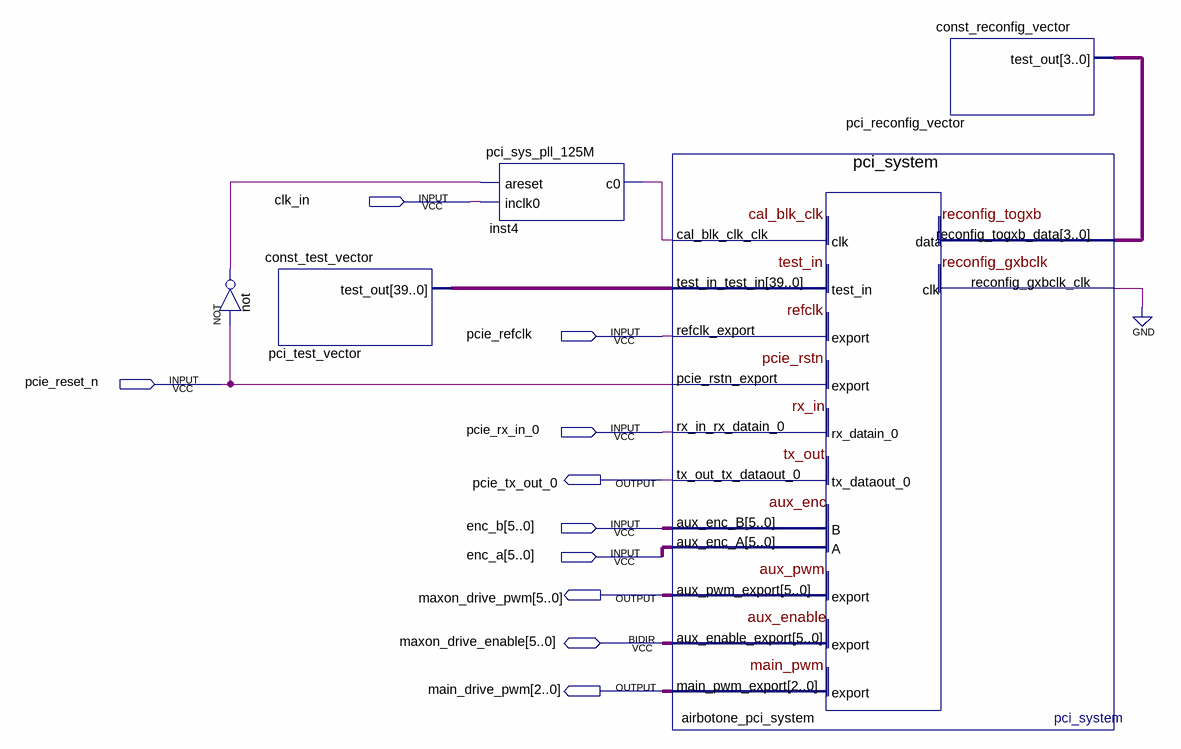
[diagram p0: schematic sheet]
// Quartus schematic top.bdf as structural Verilog: 5 symbols, 10 pins
module top (
  input  clk_in,
  input  pcie_refclk,
  input  pcie_reset_n,
  input  pcie_rx_in_0,
  input  [5:0] enc_b,
  input  [5:0] enc_a,
  inout  [5:0] maxon_drive_enable,
  output pcie_tx_out_0,
  output [5:0] maxon_drive_pwm,
  output [2:0] main_drive_pwm
);

  wire inst4_c0, not_out;
  wire [3:0] pci_reconfig_vector_test_out;
  wire [39:0] pci_test_vector_test_out;

  not \not  (not_out, pcie_reset_n);
  const_test_vector pci_test_vector (.test_out(pci_test_vector_test_out));
  pci_sys_pll_125M inst4 (.areset(not_out), .inclk0(clk_in), .c0(inst4_c0));
  pci_system airbotone_pci_system (
    .cal_blk_clk_clk(inst4_c0), .test_in_test_in(pci_test_vector_test_out), .refclk_export(pcie_refclk),
    .pcie_rstn_export(pcie_reset_n), .rx_in_rx_datain_0(pcie_rx_in_0),
    .reconfig_togxb_data(pci_reconfig_vector_test_out), .reconfig_gxbclk_clk(1'b0), .aux_enc_B(enc_b),
    .aux_enc_A(enc_a), .tx_out_tx_dataout_0(pcie_tx_out_0), .aux_pwm_export(maxon_drive_pwm),
    .main_pwm_export(main_drive_pwm), .aux_enable_export(maxon_drive_enable));
  const_reconfig_vector pci_reconfig_vector (.test_out(pci_reconfig_vector_test_out));
endmodule
